# EasyEDA Pro project ProDoc_LED_2025-05-25.epro

# Board LED
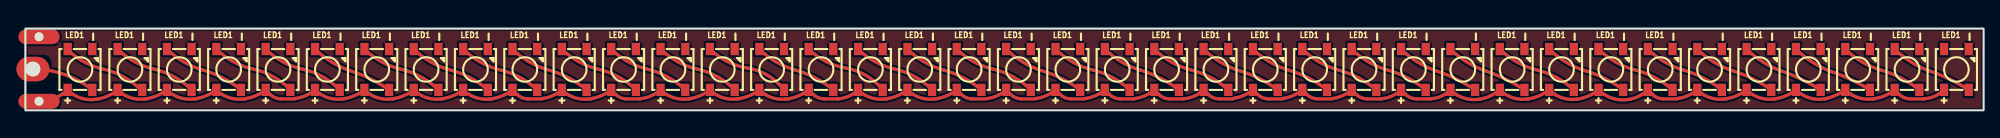
[diagram p0: board, top side]
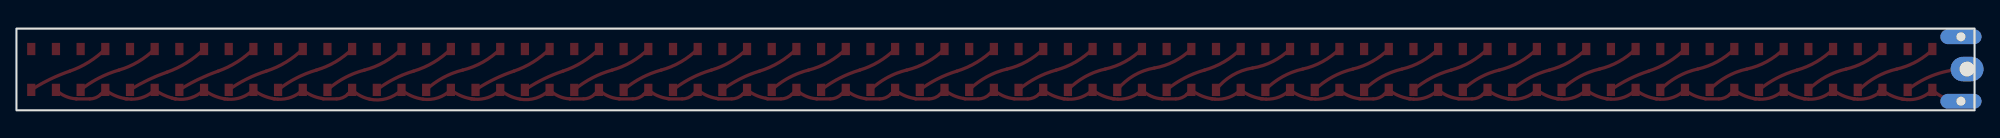
[diagram p1: board, bottom side, seen from below]

Outline 238 x 10 mm; copper layers: Top Layer, Bottom Layer. Coordinates in mm from the lower left corner of the outline.
Outline path: rectangle 0,10 238,0
Stack: Top Layer 0.035mm / Dielectric1 1.51mm FR4 er 4.5 / Bottom Layer 0.035mm

## Design rules (mm)
template: 自定义配置
spacing copperThickness1oz (default): track to track 0.1, other pairs 0.1 to 0.1
track width copperThickness1oz (default): min 0.1, default 0.2, max 2.54
track width copperThickness2oz: min 0.203, default 0.254, max 2.54
differential pair differentialPair (default): width min 0.127, default 0.254, max 2.54; gap min 0.152, default 0.152
via viaSize (default): diameter min 0.5, default 0.61, max 10; hole min 0.3, default 0.305, max 6.3

## Placement (name value [footprint] x y rotation side)
LED1  -  [LED-SMD_4P-L5.0-W5.0-BL_XL-5050RGBC]  12.7 5 0 top
LED1#2  -  [LED-SMD_4P-L5.0-W5.0-BL_XL-5050RGBC]  6.63 5 0 top
LED1#3  -  [LED-SMD_4P-L5.0-W5.0-BL_XL-5050RGBC]  18.7 5 0 top
LED1#4  -  [LED-SMD_4P-L5.0-W5.0-BL_XL-5050RGBC]  24.7 5 0 top
LED1#5  -  [LED-SMD_4P-L5.0-W5.0-BL_XL-5050RGBC]  30.7 5 0 top
LED1#6  -  [LED-SMD_4P-L5.0-W5.0-BL_XL-5050RGBC]  36.7 5 0 top
LED1#7  -  [LED-SMD_4P-L5.0-W5.0-BL_XL-5050RGBC]  42.7 5 0 top
LED1#8  -  [LED-SMD_4P-L5.0-W5.0-BL_XL-5050RGBC]  48.7 5 0 top
LED1#9  -  [LED-SMD_4P-L5.0-W5.0-BL_XL-5050RGBC]  54.7 5 0 top
LED1#10  -  [LED-SMD_4P-L5.0-W5.0-BL_XL-5050RGBC]  60.7 5 0 top
LED1#11  -  [LED-SMD_4P-L5.0-W5.0-BL_XL-5050RGBC]  66.7 5 0 top
LED1#12  -  [LED-SMD_4P-L5.0-W5.0-BL_XL-5050RGBC]  72.7 5 0 top
LED1#13  -  [LED-SMD_4P-L5.0-W5.0-BL_XL-5050RGBC]  78.7 5 0 top
LED1#14  -  [LED-SMD_4P-L5.0-W5.0-BL_XL-5050RGBC]  84.7 5 0 top
LED1#15  -  [LED-SMD_4P-L5.0-W5.0-BL_XL-5050RGBC]  90.7 5 0 top
LED1#16  -  [LED-SMD_4P-L5.0-W5.0-BL_XL-5050RGBC]  96.7 5 0 top
LED1#17  -  [LED-SMD_4P-L5.0-W5.0-BL_XL-5050RGBC]  102.7 5 0 top
LED1#18  -  [LED-SMD_4P-L5.0-W5.0-BL_XL-5050RGBC]  108.7 5 0 top
LED1#19  -  [LED-SMD_4P-L5.0-W5.0-BL_XL-5050RGBC]  114.7 5 0 top
LED1#20  -  [LED-SMD_4P-L5.0-W5.0-BL_XL-5050RGBC]  120.7 5 0 top
LED1#21  -  [LED-SMD_4P-L5.0-W5.0-BL_XL-5050RGBC]  126.7 5 0 top
LED1#22  -  [LED-SMD_4P-L5.0-W5.0-BL_XL-5050RGBC]  132.7 5 0 top
LED1#23  -  [LED-SMD_4P-L5.0-W5.0-BL_XL-5050RGBC]  138.7 5 0 top
LED1#24  -  [LED-SMD_4P-L5.0-W5.0-BL_XL-5050RGBC]  144.7 5 0 top
LED1#25  -  [LED-SMD_4P-L5.0-W5.0-BL_XL-5050RGBC]  150.7 5 0 top
LED1#26  -  [LED-SMD_4P-L5.0-W5.0-BL_XL-5050RGBC]  156.7 5 0 top
LED1#27  -  [LED-SMD_4P-L5.0-W5.0-BL_XL-5050RGBC]  162.7 5 0 top
LED1#28  -  [LED-SMD_4P-L5.0-W5.0-BL_XL-5050RGBC]  168.7 5 0 top
LED1#29  -  [LED-SMD_4P-L5.0-W5.0-BL_XL-5050RGBC]  174.7 5 0 top
LED1#30  -  [LED-SMD_4P-L5.0-W5.0-BL_XL-5050RGBC]  180.7 5 0 top
LED1#31  -  [LED-SMD_4P-L5.0-W5.0-BL_XL-5050RGBC]  186.7 5 0 top
LED1#32  -  [LED-SMD_4P-L5.0-W5.0-BL_XL-5050RGBC]  192.7 5 0 top
LED1#33  -  [LED-SMD_4P-L5.0-W5.0-BL_XL-5050RGBC]  198.7 5 0 top
LED1#34  -  [LED-SMD_4P-L5.0-W5.0-BL_XL-5050RGBC]  204.7 5 0 top
LED1#35  -  [LED-SMD_4P-L5.0-W5.0-BL_XL-5050RGBC]  210.7 5 0 top
LED1#36  -  [LED-SMD_4P-L5.0-W5.0-BL_XL-5050RGBC]  216.7 5 0 top
LED1#37  -  [LED-SMD_4P-L5.0-W5.0-BL_XL-5050RGBC]  222.7 5 0 top
LED1#38  -  [LED-SMD_4P-L5.0-W5.0-BL_XL-5050RGBC]  228.7 5 0 top
LED1#39  -  [LED-SMD_4P-L5.0-W5.0-BL_XL-5050RGBC]  234.7 5 0 top
NOREF  -  [Pad_e305]  1.65 1.11 0 top
NOREF#2  -  [Pad_e306]  1.65 9 0 top
NOREF#3  -  [Pad_e3859]  0.91 5.05 0 top

## Footprints (pads in the part's own frame, mm; a bottom-side part is the same pattern mirrored in y, then rotated)
LED-SMD_4P-L5.0-W5.0-BL_XL-5050RGBC
  rect 1x1.5 smd: 1(-1.5,-2.5) 2(1.5,-2.5) 3(1.5,2.5) 4(-1.5,2.5)
Pad_e305
  oval 5x1.8 hole 1.08x0.5: 1(0,0)
Pad_e306
  oval 5x1.8 hole 1.08x0.5: 2(0,0)
Pad_e3859
  rrect 4x3 hole 1.8x0.5: 1(0,0)

## Nets
GND: LED1.3 LED1#2.3 LED1#3.3 LED1#4.3 LED1#5.3 LED1#6.3 LED1#7.3 LED1#8.3 LED1#9.3 LED1#10.3 LED1#11.3 LED1#12.3 LED1#13.3 LED1#14.3 LED1#15.3 LED1#16.3 LED1#17.3 LED1#18.3 LED1#19.3 LED1#20.3 LED1#21.3 LED1#22.3 LED1#23.3 LED1#24.3 LED1#25.3 LED1#26.3 LED1#27.3 LED1#28.3 LED1#29.3 LED1#30.3 LED1#31.3 LED1#32.3 LED1#33.3 LED1#34.3 LED1#35.3 LED1#36.3 LED1#37.3 LED1#38.3 LED1#39.3 NOREF#2.2
VCC: LED1.1 LED1#2.1 LED1#3.1 LED1#4.1 LED1#5.1 LED1#6.1 LED1#7.1 LED1#8.1 LED1#9.1 LED1#10.1 LED1#11.1 LED1#12.1 LED1#13.1 LED1#14.1 LED1#15.1 LED1#16.1 LED1#17.1 LED1#18.1 LED1#19.1 LED1#20.1 LED1#21.1 LED1#22.1 LED1#23.1 LED1#24.1 LED1#25.1 LED1#26.1 LED1#27.1 LED1#28.1 LED1#29.1 LED1#30.1 LED1#31.1 LED1#32.1 LED1#33.1 LED1#34.1 LED1#35.1 LED1#36.1 LED1#37.1 LED1#38.1 LED1#39.1 NOREF.1

Pads without a net: LED1 2 4; LED1#2 2 4; LED1#3 2 4; LED1#4 2 4; LED1#5 2 4; LED1#6 2 4; LED1#7 2 4; LED1#8 2 4; LED1#9 2 4; LED1#10 2 4; LED1#11 2 4; LED1#12 2 4; LED1#13 2 4; LED1#14 2 4; LED1#15 2 4; LED1#16 2 4; LED1#17 2 4; LED1#18 2 4; LED1#19 2 4; LED1#20 2 4; LED1#21 2 4; LED1#22 2 4; LED1#23 2 4; LED1#24 2 4; LED1#25 2 4; LED1#26 2 4; LED1#27 2 4; LED1#28 2 4; LED1#29 2 4; LED1#30 2 4; LED1#31 2 4; LED1#32 2 4; LED1#33 2 4; LED1#34 2 4; LED1#35 2 4; LED1#36 2 4; LED1#37 2 4; LED1#38 2 4; LED1#39 2 4; NOREF#3 1

## Routing (per net, layer and track width the routed paths; a pad name or vN(x,y) marks a point on that pad's centre or on a via; arc(x,y) is an arc through that point)
VCC: length 254.6
  Top Layer w0.4: 11.18,2.45 arc(10.08,1.79) 8.86,1.4 arc(8.78,1.36) 8.68,1.35 8.55,1.35 arc(8.38,1.33) 8.21,1.31 arc(6.77,1.49) 5.5,2.17 ; LED1#39.1 arc(232.09,1.74) 230.78,1.41 arc(230.74,1.4) 230.7,1.4 229.08,1.4 arc(228.36,1.54) 227.75,1.95 LED1#38.1 arc(226.11,1.84) 224.89,1.45 arc(224.8,1.41) 224.7,1.4 224.53,1.4 arc(224.28,1.38) 224.03,1.36 arc(222.5,1.64) LED1#37.1 arc(220.18,1.91) 219.08,1.49 arc(218.97,1.46) 218.86,1.44 arc(218.78,1.41) 218.7,1.4 218.66,1.4 arc(216.8,1.53) LED1#36.1 arc(214.09,1.83) 212.86,1.44 arc(212.78,1.41) 212.7,1.4 212.63,1.4 arc(212.49,1.38) 212.34,1.36 arc(210.65,1.58) LED1#35.1 arc(208.1,1.84) 206.88,1.45 arc(206.79,1.41) 206.7,1.4 206.58,1.4 arc(206.41,1.38) 206.25,1.36 arc(204.6,1.6) LED1#34.1 arc(202.12,1.82) 200.89,1.46 arc(200.8,1.41) 200.7,1.4 199.08,1.4 arc(198.36,1.54) 197.75,1.95 LED1#33.1 arc(196.21,1.78) 195.07,1.36 arc(192.99,1.44) LED1#32.1 arc(189.98,1.75) 188.59,1.36 arc(186.76,1.53) LED1#31.1 arc(184.09,1.83) 182.85,1.43 arc(182.78,1.41) 182.7,1.4 182.65,1.4 arc(182.51,1.38) 182.37,1.36 arc(180.66,1.58) LED1#30.1 arc(178.07,1.77) 176.78,1.36 arc(174.85,1.49) LED1#29.1 arc(172.08,1.72) 170.76,1.4 arc(170.73,1.4) 170.7,1.4 169.08,1.4 arc(168.36,1.54) 167.75,1.95 LED1#28.1 arc(166.09,1.75) 164.8,1.41 arc(164.75,1.4) 164.7,1.4 163.08,1.4 arc(162.36,1.54) 161.75,1.95 LED1#27.1 arc(160.11,1.8) 158.87,1.44 arc(158.79,1.41) 158.7,1.4 157.08,1.4 arc(156.36,1.54) 155.75,1.95 LED1#26.1 arc(154.12,1.82) 152.9,1.46 arc(152.8,1.41) 152.7,1.4 151.08,1.4 arc(150.36,1.54) 149.75,1.95 LED1#25.1 arc(148.12,1.84) 146.92,1.47 arc(146.81,1.42) 146.7,1.4 145.08,1.4 arc(144.36,1.54) 143.75,1.95 LED1#24.1 arc(142.09,1.75) 140.8,1.41 arc(140.75,1.4) 140.7,1.4 139.08,1.4 arc(138.36,1.54) 137.75,1.95 LED1#23.1 arc(136.11,1.8) 134.87,1.44 arc(134.79,1.41) 134.7,1.4 133.08,1.4 arc(132.36,1.54) 131.75,1.95 LED1#22.1 arc(130.12,1.82) 128.9,1.46 arc(128.8,1.41) 128.7,1.4 127.08,1.4 arc(126.36,1.54) 125.75,1.95 LED1#21.1 arc(124.12,1.82) 122.89,1.45 arc(122.8,1.41) 122.7,1.4 121.08,1.4 arc(120.36,1.54) 119.75,1.95 LED1#20.1 arc(118.1,1.78) 116.84,1.43 arc(116.77,1.41) 116.7,1.4 115.08,1.4 arc(114.36,1.54) 113.75,1.95 LED1#19.1 arc(112.1,1.84) 110.88,1.45 arc(110.79,1.41) 110.7,1.4 110.57,1.4 arc(110.4,1.38) 110.24,1.36 arc(108.59,1.6) LED1#18.1 arc(106.11,1.84) 104.89,1.45 arc(104.8,1.41) 104.7,1.4 104.54,1.4 arc(104.34,1.38) 104.14,1.36 arc(102.55,1.62) LED1#17.1 arc(100.08,1.73) 98.77,1.4 arc(98.73,1.4) 98.7,1.4 97.08,1.4 arc(96.36,1.54) 95.75,1.95 LED1#16.1 arc(94.1,1.83) 92.86,1.44 arc(92.78,1.41) 92.7,1.4 92.62,1.4 arc(92.48,1.38) 92.33,1.36 arc(90.64,1.58) LED1#15.1 arc(88.11,1.84) 86.89,1.45 arc(86.8,1.41) 86.7,1.4 86.53,1.4 arc(86.32,1.38) 86.11,1.36 arc(84.53,1.63) LED1#14.1 arc(82.11,1.84) 80.89,1.45 arc(80.8,1.41) 80.7,1.4 80.54,1.4 arc(80.34,1.38) 80.14,1.36 arc(78.55,1.62) LED1#13.1 arc(76.11,1.79) 74.86,1.43 arc(74.78,1.41) 74.7,1.4 73.08,1.4 arc(72.36,1.54) 71.75,1.95 LED1#12.1 arc(70.1,1.84) 68.88,1.45 arc(68.8,1.41) 68.7,1.4 68.56,1.4 arc(68.38,1.38) 68.2,1.36 arc(66.58,1.61) LED1#11.1 arc(64.11,1.81) 62.87,1.44 arc(62.79,1.41) 62.7,1.4 61.08,1.4 arc(60.36,1.54) 59.75,1.95 LED1#10.1 arc(58.1,1.83) 56.88,1.45 arc(56.79,1.41) 56.7,1.4 56.58,1.4 arc(56.42,1.38) 56.26,1.36 arc(54.61,1.6) LED1#9.1 arc(52.11,1.84) 50.89,1.45 arc(50.8,1.41) 50.7,1.4 50.55,1.4 arc(50.36,1.38) 50.16,1.36 arc(48.56,1.62) LED1#8.1 arc(46.1,1.84) 44.88,1.45 arc(44.8,1.41) 44.7,1.4 44.56,1.4 arc(44.38,1.38) 44.2,1.36 arc(42.58,1.61) LED1#7.1 arc(40.1,1.84) 38.88,1.45 arc(38.79,1.41) 38.7,1.4 38.57,1.4 arc(38.4,1.38) 38.23,1.36 arc(36.59,1.6) LED1#6.1 arc(34.12,1.83) 32.9,1.46 arc(32.8,1.41) 32.7,1.4 31.08,1.4 arc(30.36,1.54) 29.75,1.95 LED1#5.1 arc(28.11,1.84) 26.89,1.45 arc(26.8,1.41) 26.7,1.4 26.54,1.4 arc(26.35,1.38) 26.16,1.36 arc(24.56,1.62) LED1#4.1 arc(22.1,1.84) 20.88,1.45 arc(20.8,1.41) 20.7,1.4 20.56,1.4 arc(20.37,1.38) 20.19,1.36 arc(18.57,1.61) LED1#3.1 arc(16.1,1.84) 14.88,1.45 arc(14.79,1.41) 14.7,1.4 14.57,1.4 arc(14.4,1.38) 14.22,1.36 arc(12.79,1.54) 11.52,2.22 arc(11.35,2.35) LED1.1 ; NOREF.1 arc(3.53,1.47) LED1#2.1
  Top Layer w0.6: 11.52,2.22 arc(11.55,2.23) 11.58,2.25
(no net): length 403.3
  Top Layer w0.3: LED1.4 arc(11.44,7.28) 11.67,7.06
  Top Layer w0.4: LED1#5.2 arc(30.13,4.11) 27.69,5.05 arc(25.27,5.95) LED1#4.4 ; LED1#9.2 arc(54.09,3.98) 51.69,4.92 arc(49.27,5.91) LED1#8.4 ; LED1#31.2 arc(186.14,4) 183.77,4.92 arc(181.31,5.9) LED1#30.4 ; LED1#6.2 arc(36.11,4.1) 33.66,5.05 arc(31.25,5.96) LED1#5.4 ; LED1#34.2 arc(203.99,3.94) 201.55,4.92 arc(199.21,5.94) LED1#33.4 ; LED1#7.2 arc(42,3.82) 39.62,4.79 arc(37.25,5.88) LED1#6.4 ; LED1#9.4 arc(55.32,5.9) 57.78,4.92 arc(60.15,4) LED1#10.2 ; LED1#34.4 arc(205.26,5.88) 207.65,4.79 arc(210.01,3.83) LED1#35.2 ; LED1#16.4 arc(97.27,5.99) 99.69,5.17 arc(102.19,4.25) LED1#17.2 ; LED1#24.4 arc(145.28,5.87) 147.7,4.79 arc(150.05,3.84) LED1#25.2 ; LED1#37.4 arc(223.21,5.94) 225.55,4.92 arc(227.99,3.94) LED1#38.2 ; LED1#12.2 arc(72.07,4.09) 69.6,5.05 arc(67.23,5.97) LED1#11.4 ; LED1#32.2 arc(192.07,3.85) 189.74,4.79 arc(187.3,5.86) LED1#31.4 ; LED1#20.4 arc(121.28,5.87) 123.7,4.79 arc(126.05,3.84) LED1#21.2 ; LED1#30.2 arc(179.95,3.8) 177.55,4.79 arc(175.22,5.9) LED1#29.4 ; LED1#22.2 arc(132.16,4) 129.79,4.92 arc(127.32,5.89) LED1#21.4 ; LED1#11.2 arc(66.05,3.96) 63.63,4.92 arc(61.25,5.92) LED1#10.4 ; LED1#4.2 arc(24.02,3.95) 21.59,4.92 arc(19.23,5.93) LED1#3.4 ; LED1#23.2 arc(137.97,3.92) 135.51,4.92 arc(133.2,5.94) LED1#22.4 ; LED1#36.4 arc(217.3,5.83) 219.71,4.67 arc(222.02,3.71) LED1#37.2 ; LED1#32.4 arc(193.28,5.91) 195.71,4.92 arc(198.1,3.98) LED1#33.2 ; LED1#35.4 arc(211.19,5.91) 213.49,4.79 arc(215.91,3.78) LED1#36.2 ; LED1#39.2 arc(233.93,3.79) 231.52,4.79 arc(229.21,5.9) LED1#38.4 ; LED1#12.4 arc(73.21,5.97) 75.56,5.05 arc(78.05,4.08) LED1#13.2 ; 5.5,7.06 arc(7.35,5.81) 9.45,5.05 arc(11.92,4.1) 14.03,2.5 ; LED1#18.4 arc(109.25,5.92) 111.63,4.92 arc(114.05,3.96) LED1#19.2 ; LED1#3.2 arc(18.09,4.1) 15.62,5.05 arc(13.52,5.81) 11.67,7.06 arc(11.43,7.28) LED1.4 ; LED1#18.2 arc(108.12,4.11) 105.66,5.05 arc(103.26,5.96) LED1#17.4 ; LED1#14.4 arc(85.29,5.98) 87.76,5.17 arc(90.24,4.27) LED1#15.2 ; LED1#14.2 arc(84.12,4.11) 81.66,5.05 arc(79.26,5.96) LED1#13.4 ; LED1#25.4 arc(151.21,5.94) 153.54,4.92 arc(155.99,3.93) LED1#26.2 ; LED1#7.4 arc(43.23,5.97) 45.59,5.05 arc(48.07,4.09) LED1#8.2 ; LED1#15.4 arc(91.23,5.93) 93.6,4.92 arc(96.03,3.95) LED1#16.2 ; LED1#23.4 arc(139.29,5.9) 141.73,4.92 arc(144.12,3.99) LED1#24.2 ; LED1#20.2 arc(120.08,4.09) 117.6,5.05 arc(115.23,5.97) LED1#19.4 ; LED1#29.2 arc(173.97,3.81) 171.58,4.79 arc(169.23,5.89) LED1#28.4 ; LED1#28.2 arc(168.03,3.95) 165.61,4.92 arc(163.24,5.93) LED1#27.4 ; LED1#27.2 arc(162.05,3.96) 159.64,4.92 arc(157.25,5.92) LED1#26.4 ; NOREF#3.1 arc(4.74,4.39) LED1#2.2

## Copper pours and planes (outline as drawn; the poured copper is in the pictures)
GND on Top Layer: -2.03,10.47 238,10.47 238,-0.35 -2.03,-0.35
